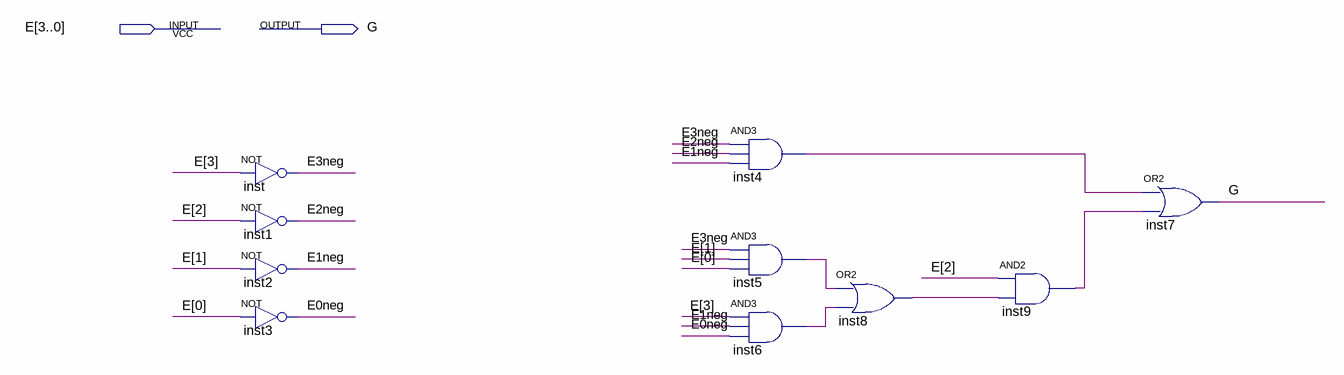
[diagram p0: schematic sheet]
// Quartus schematic letraG.bdf as structural Verilog: 10 symbols, 2 pins
module letraG (
  input  [3:0] E,
  output G
);

  wire E0neg, E1neg, E2neg, E3neg, inst4_out, inst5_out, inst6_out, inst8_out, inst9_out;

  not inst (E3neg, E[3]);
  not inst1 (E2neg, E[2]);
  not inst2 (E1neg, E[1]);
  not inst3 (E0neg, E[0]);
  and inst4 (inst4_out, E3neg, E2neg, E1neg);
  and inst5 (inst5_out, E3neg, E[1], E[0]);
  and inst6 (inst6_out, E[3], E1neg, E0neg);
  or inst8 (inst8_out, inst5_out, inst6_out);
  and inst9 (inst9_out, E[2], inst8_out);
  or inst7 (G, inst4_out, inst9_out);
endmodule
